# Altium schematic sheet AUDIO_AMP.SchDoc
size A4; SheetNumber: 34; SheetTotal: 35
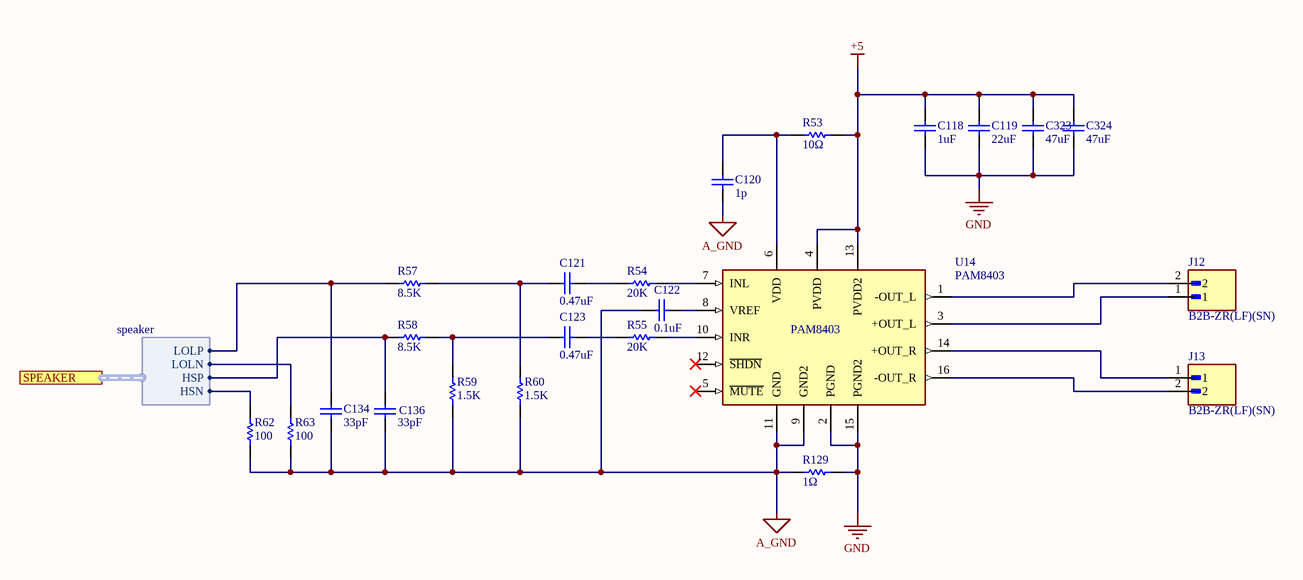
[diagram p0: AUDIO_AMP.SchDoc]

## Parts
C118  value 1uF  [C0805]  (hidden comment: C0805)
C119  value 22uF  [C1210]  (hidden comment: C1210)
C120  value 1p  [C0402]  (hidden comment: C0402)
C121  value 0.47uF  [C0603]  (hidden comment: C0603)
C122  value 0.1uF  [C0603]  (hidden comment: C0603)
C123  value 0.47uF  [C0603]  (hidden comment: C0603)
C134  value 33pF  [C0402]  (hidden comment: C0402)
C136  value 33pF  [C0402]  (hidden comment: C0402)
C323  value 47uF  [C1812]  (hidden comment: C1812)
C324  value 47uF  [C1812]  (hidden comment: C1812)
J12  B2B-ZR(LF)(SN)  [JST_B2B-ZR(LF)(SN)]
J13  B2B-ZR(LF)(SN)  [JST_B2B-ZR(LF)(SN)]
R53  value 10Ω  [R0603]  (hidden comment: R0603)
R54  value 20K  [R0603]  (hidden comment: R0603)
R55  value 20K  [R0603]  (hidden comment: R0603)
R57  value 8.5K  [R0603]  (hidden comment: R0603)
R58  value 8.5K  [R0603]  (hidden comment: R0603)
R59  value 1.5K  [R0603]  (hidden comment: R0603)
R60  value 1.5K  [R0603]  (hidden comment: R0603)
R62  value 100  [R0603]  (hidden comment: R0603)
R63  value 100  [R0603]  (hidden comment: R0603)
R129  value 1Ω  [R0603]  (hidden comment: R0603)
U14  PAM8403  [SOP-16]

## Ports
SPEAKER (harness speaker, see main[4000,1100], AU[14100,7200], Power[5800,3800])

## Harnesses
speaker: LOLP, LOLN, HSP, HSN

## Nets
+5: C118.1 C119.2 C323.2 C324.2 R53.2 U14.4(PVDD) U14.13(PVDD2)
A_GND: C120.1 C122.2 C134.1 C136.1 R59.1 R60.1 R62.1 R63.1 R129.1 U14.9(GND2) U14.11(GND)
GND: C118.2 C119.1 C323.1 C324.1 R129.2 U14.2(PGND) U14.15(PGND2)
NetC120_2: C120.2 R53.1 U14.6(VDD)
NetC121_1: C121.1 R54.1
NetC121_2: C121.2 R57.2 R60.2
NetC122_1: C122.1 U14.8(VREF)
NetC123_1: C123.1 R55.1
NetC123_2: C123.2 R58.2 R59.2
NetC134_2: C134.2 R57.1 ; port SPEAKER.LOLP
NetC136_2: C136.2 R58.1 ; port SPEAKER.HSP
NetJ12_1: J12.1 U14.3(+OUT_L)
NetJ12_2: J12.2 U14.1(-OUT_L)
NetJ13_1: J13.1 U14.14(+OUT_R)
NetJ13_2: J13.2 U14.16(-OUT_R)
NetR54_2: R54.2 U14.7(INL)
NetR55_2: R55.2 U14.10(INR)
NetR62_2: R62.2 ; port SPEAKER.HSN
NetR63_2: R63.2 ; port SPEAKER.LOLN

Not connected (* = marked no-connect by the designer): U14 5(~{MUTE})* 12(~{SHDN})*

## Library data of the parts
J12 J13 = B2B-ZR(LF)(SN): Connector Header Through Hole 2 position 0.059 (1.50mm)
U14 = PAM8403: Audio Amp Speaker 2-CH Stereo 3.2W Class-D 16-Pin SOP T/R